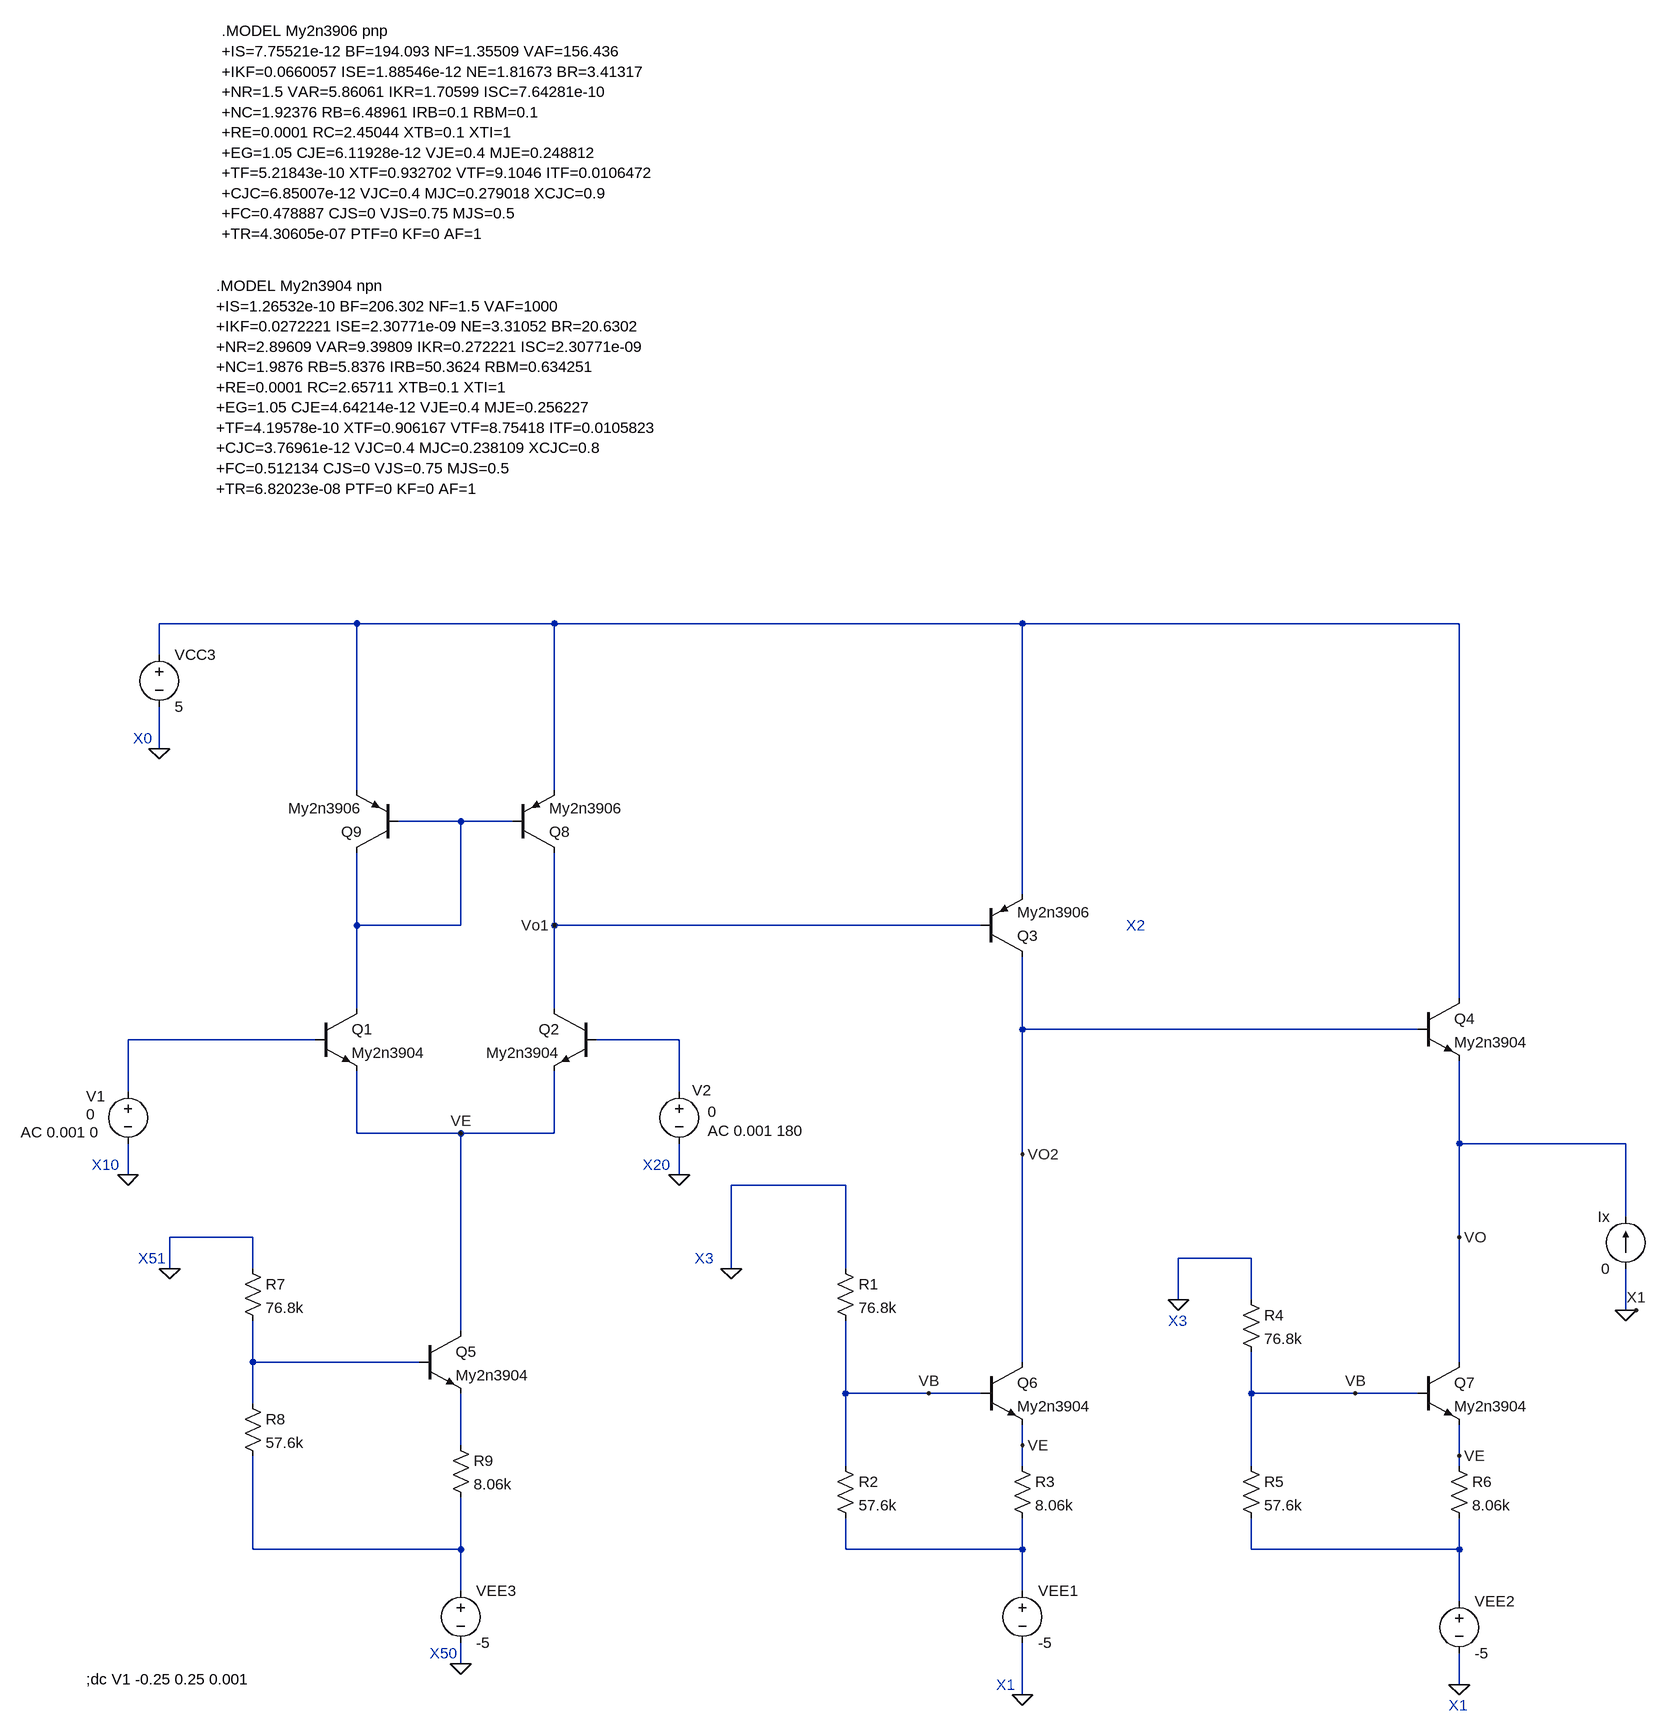
[diagram p0: schematic Draft1.asc]
Draft1.asc, the LTspice schematic file:
Version 4
SHEET 1 2440 2240
WIRE -1824 -704 -2128 -704
WIRE -1520 -704 -1824 -704
WIRE -800 -704 -1520 -704
WIRE -128 -704 -800 -704
WIRE -2128 -656 -2128 -704
WIRE -2128 -512 -2128 -576
WIRE -1824 -448 -1824 -704
WIRE -1520 -448 -1520 -704
WIRE -1664 -400 -1760 -400
WIRE -1584 -400 -1664 -400
WIRE -800 -288 -800 -704
WIRE -1824 -240 -1824 -352
WIRE -1664 -240 -1664 -400
WIRE -1664 -240 -1824 -240
WIRE -1520 -240 -1520 -352
WIRE -864 -240 -1520 -240
WIRE -128 -128 -128 -704
WIRE -1824 -112 -1824 -240
WIRE -1520 -112 -1520 -240
WIRE -800 -80 -800 -192
WIRE -192 -80 -800 -80
WIRE -1888 -64 -2176 -64
WIRE -1328 -64 -1456 -64
WIRE -2176 16 -2176 -64
WIRE -1328 16 -1328 -64
WIRE -1824 80 -1824 -16
WIRE -1664 80 -1824 80
WIRE -1520 80 -1520 -16
WIRE -1520 80 -1664 80
WIRE -128 96 -128 -32
WIRE 128 96 -128 96
WIRE -800 112 -800 -80
WIRE -2176 144 -2176 96
WIRE -1328 144 -1328 96
WIRE -1072 160 -1248 160
WIRE 128 208 128 96
WIRE -1984 240 -2112 240
WIRE -128 240 -128 96
WIRE -448 272 -560 272
WIRE -2112 288 -2112 240
WIRE -1984 288 -1984 240
WIRE -1248 288 -1248 160
WIRE -1072 288 -1072 160
WIRE -560 336 -560 272
WIRE -448 336 -448 272
WIRE 128 352 128 288
WIRE -1664 384 -1664 80
WIRE -1984 432 -1984 368
WIRE -1728 432 -1984 432
WIRE -800 432 -800 112
WIRE -128 432 -128 240
WIRE -1072 480 -1072 368
WIRE -944 480 -1072 480
WIRE -864 480 -944 480
WIRE -448 480 -448 416
WIRE -288 480 -448 480
WIRE -192 480 -288 480
WIRE -1984 496 -1984 432
WIRE -1664 560 -1664 480
WIRE -800 560 -800 528
WIRE -128 576 -128 528
WIRE -1072 592 -1072 480
WIRE -800 592 -800 560
WIRE -448 592 -448 480
WIRE -128 592 -128 576
WIRE -1984 720 -1984 576
WIRE -1664 720 -1664 640
WIRE -1664 720 -1984 720
WIRE -1072 720 -1072 672
WIRE -800 720 -800 672
WIRE -800 720 -1072 720
WIRE -448 720 -448 672
WIRE -128 720 -128 672
WIRE -128 720 -448 720
WIRE -1664 784 -1664 720
WIRE -800 784 -800 720
WIRE -128 800 -128 720
WIRE -1664 896 -1664 864
WIRE -128 928 -128 880
WIRE -800 944 -800 864
FLAG -1248 288 0
FLAG -800 944 0
FLAG -944 480 VB
FLAG -800 112 VO2
FLAG -800 560 VE
FLAG -560 336 0
FLAG -128 928 0
FLAG -288 480 VB
FLAG -128 240 VO
FLAG -128 576 VE
FLAG -2128 -512 0
FLAG -2176 144 0
FLAG -2112 288 0
FLAG -1664 896 0
FLAG -1664 80 VE
FLAG -1520 -240 Vo1
FLAG -1328 144 0
FLAG 128 352 0
FLAG 144 352 X1
SYMBOL res -1088 272 R0
SYMATTR InstName R1
SYMATTR Value 76.8k
SYMBOL res -1088 576 R0
SYMATTR InstName R2
SYMATTR Value 57.6k
SYMBOL res -816 576 R0
SYMATTR InstName R3
SYMATTR Value 8.06k
SYMBOL voltage -800 768 R0
WINDOW 123 0 0 Left 0
WINDOW 39 0 0 Left 0
SYMATTR InstName VEE1
SYMATTR Value -5
SYMBOL npn -864 432 R0
SYMATTR InstName Q6
SYMATTR Value My2n3904
SYMBOL pnp -864 -192 M180
SYMATTR InstName Q3
SYMATTR Value My2n3906
SYMBOL res -464 320 R0
SYMATTR InstName R4
SYMATTR Value 76.8k
SYMBOL res -464 576 R0
SYMATTR InstName R5
SYMATTR Value 57.6k
SYMBOL res -144 576 R0
SYMATTR InstName R6
SYMATTR Value 8.06k
SYMBOL voltage -128 784 R0
WINDOW 123 0 0 Left 0
WINDOW 39 0 0 Left 0
SYMATTR InstName VEE2
SYMATTR Value -5
SYMBOL npn -192 432 R0
SYMATTR InstName Q7
SYMATTR Value My2n3904
SYMBOL npn -192 -128 R0
SYMATTR InstName Q4
SYMATTR Value My2n3904
SYMBOL res -2000 272 R0
SYMATTR InstName R7
SYMATTR Value 76.8k
SYMBOL res -2000 480 R0
SYMATTR InstName R8
SYMATTR Value 57.6k
SYMBOL res -1680 544 R0
SYMATTR InstName R9
SYMATTR Value 8.06k
SYMBOL voltage -2128 -672 R0
WINDOW 123 0 0 Left 0
WINDOW 39 0 0 Left 0
SYMATTR InstName VCC3
SYMATTR Value 5
SYMBOL npn -1888 -112 R0
SYMATTR InstName Q1
SYMATTR Value My2n3904
SYMBOL npn -1456 -112 M0
SYMATTR InstName Q2
SYMATTR Value My2n3904
SYMBOL voltage -2176 0 R0
WINDOW 0 -64 23 Left 2
WINDOW 3 -64 51 Left 2
WINDOW 123 -165 78 Left 2
WINDOW 39 0 0 Left 0
SYMATTR InstName V1
SYMATTR Value 0
SYMATTR Value2 AC 0.001 0
SYMBOL npn -1728 384 R0
SYMATTR InstName Q5
SYMATTR Value My2n3904
SYMBOL voltage -1664 768 R0
WINDOW 123 0 0 Left 0
WINDOW 39 0 0 Left 0
SYMATTR InstName VEE3
SYMATTR Value -5
SYMBOL voltage -1328 0 R0
WINDOW 0 20 14 Left 2
WINDOW 3 44 47 Left 2
WINDOW 123 44 76 Left 2
WINDOW 39 0 0 Left 0
SYMATTR InstName V2
SYMATTR Value 0
SYMATTR Value2 AC 0.001 180
SYMBOL pnp -1760 -352 R180
SYMATTR InstName Q9
SYMATTR Value My2n3906
SYMBOL pnp -1584 -352 M180
SYMATTR InstName Q8
SYMATTR Value My2n3906
SYMBOL current 128 288 R180
WINDOW 0 24 80 Left 2
WINDOW 3 24 0 Left 2
WINDOW 123 0 0 Left 0
WINDOW 39 0 0 Left 0
SYMATTR InstName Ix
SYMATTR Value 0
TEXT -1304 272 Left 2 ;X3
TEXT -840 928 Left 2 ;X1
TEXT -640 -240 Left 2 ;X2
TEXT -576 368 Left 2 ;X3
TEXT -144 960 Left 2 ;X1
TEXT -2168 -528 Left 2 ;X0
TEXT -2232 128 Left 2 ;X10
TEXT -2160 272 Left 2 ;X51
TEXT -1712 880 Left 2 ;X50
TEXT -2040 -1224 Left 2 !.MODEL My2n3904 npn\n+IS=1.26532e-10 BF=206.302 NF=1.5 VAF=1000\n+IKF=0.0272221 ISE=2.30771e-09 NE=3.31052 BR=20.6302\n+NR=2.89609 VAR=9.39809 IKR=0.272221 ISC=2.30771e-09\n+NC=1.9876 RB=5.8376 IRB=50.3624 RBM=0.634251\n+RE=0.0001 RC=2.65711 XTB=0.1 XTI=1\n+EG=1.05 CJE=4.64214e-12 VJE=0.4 MJE=0.256227\n+TF=4.19578e-10 XTF=0.906167 VTF=8.75418 ITF=0.0105823\n+CJC=3.76961e-12 VJC=0.4 MJC=0.238109 XCJC=0.8\n+FC=0.512134 CJS=0 VJS=0.75 MJS=0.5\n+TR=6.82023e-08 PTF=0 KF=0 AF=1
TEXT -2240 920 Left 2 !;dc V1 -0.25 0.25 0.001
TEXT -2032 -1616 Left 2 !.MODEL My2n3906 pnp\n+IS=7.75521e-12 BF=194.093 NF=1.35509 VAF=156.436\n+IKF=0.0660057 ISE=1.88546e-12 NE=1.81673 BR=3.41317\n+NR=1.5 VAR=5.86061 IKR=1.70599 ISC=7.64281e-10\n+NC=1.92376 RB=6.48961 IRB=0.1 RBM=0.1\n+RE=0.0001 RC=2.45044 XTB=0.1 XTI=1\n+EG=1.05 CJE=6.11928e-12 VJE=0.4 MJE=0.248812\n+TF=5.21843e-10 XTF=0.932702 VTF=9.1046 ITF=0.0106472\n+CJC=6.85007e-12 VJC=0.4 MJC=0.279018 XCJC=0.9\n+FC=0.478887 CJS=0 VJS=0.75 MJS=0.5\n+TR=4.30605e-07 PTF=0 KF=0 AF=1
TEXT -1384 128 Left 2 ;X20

The netlist it stands for:
* Draft1.asc
R1 0 VB 76.8k
R2 VB N008 57.6k
R3 VE N008 8.06k
VEE1 N008 0 -5
Q6 VO2 VB VE 0 My2n3904
Q3 VO2 Vo1 N001 0 My2n3906
R4 0 VB 76.8k
R5 VB N009 57.6k
R6 VE N009 8.06k
VEE2 N009 0 -5
Q7 VO VB VE 0 My2n3904
Q4 N001 VO2 VO 0 My2n3904
R7 0 N005 76.8k
R8 N005 N007 57.6k
R9 N006 N007 8.06k
VCC3 N001 0 5
Q1 N002 N003 VE 0 My2n3904
Q2 Vo1 N004 VE 0 My2n3904
V1 N003 0 0 AC 0.001 0
Q5 VE N005 N006 0 My2n3904
VEE3 N007 0 -5
V2 N004 0 0 AC 0.001 180
Q9 N002 N002 N001 0 My2n3906
Q8 Vo1 N002 N001 0 My2n3906
Ix 0 VO 0
.model NPN NPN
.model PNP PNP
.lib standard.bjt
* X3
* X1
* X2
* X3
* X1
* X0
* X10
* X51
* X50
.MODEL My2n3904 npn
+IS=1.26532e-10 BF=206.302 NF=1.5 VAF=1000
+IKF=0.0272221 ISE=2.30771e-09 NE=3.31052 BR=20.6302
+NR=2.89609 VAR=9.39809 IKR=0.272221 ISC=2.30771e-09
+NC=1.9876 RB=5.8376 IRB=50.3624 RBM=0.634251
+RE=0.0001 RC=2.65711 XTB=0.1 XTI=1
+EG=1.05 CJE=4.64214e-12 VJE=0.4 MJE=0.256227
+TF=4.19578e-10 XTF=0.906167 VTF=8.75418 ITF=0.0105823
+CJC=3.76961e-12 VJC=0.4 MJC=0.238109 XCJC=0.8
+FC=0.512134 CJS=0 VJS=0.75 MJS=0.5
+TR=6.82023e-08 PTF=0 KF=0 AF=1
;dc V1 -0.25 0.25 0.001
.MODEL My2n3906 pnp
+IS=7.75521e-12 BF=194.093 NF=1.35509 VAF=156.436
+IKF=0.0660057 ISE=1.88546e-12 NE=1.81673 BR=3.41317
+NR=1.5 VAR=5.86061 IKR=1.70599 ISC=7.64281e-10
+NC=1.92376 RB=6.48961 IRB=0.1 RBM=0.1
+RE=0.0001 RC=2.45044 XTB=0.1 XTI=1
+EG=1.05 CJE=6.11928e-12 VJE=0.4 MJE=0.248812
+TF=5.21843e-10 XTF=0.932702 VTF=9.1046 ITF=0.0106472
+CJC=6.85007e-12 VJC=0.4 MJC=0.279018 XCJC=0.9
+FC=0.478887 CJS=0 VJS=0.75 MJS=0.5
+TR=4.30605e-07 PTF=0 KF=0 AF=1
* X20
.backanno
.end